# Altium project SSL-PowerBoard-2020.PrjPcb
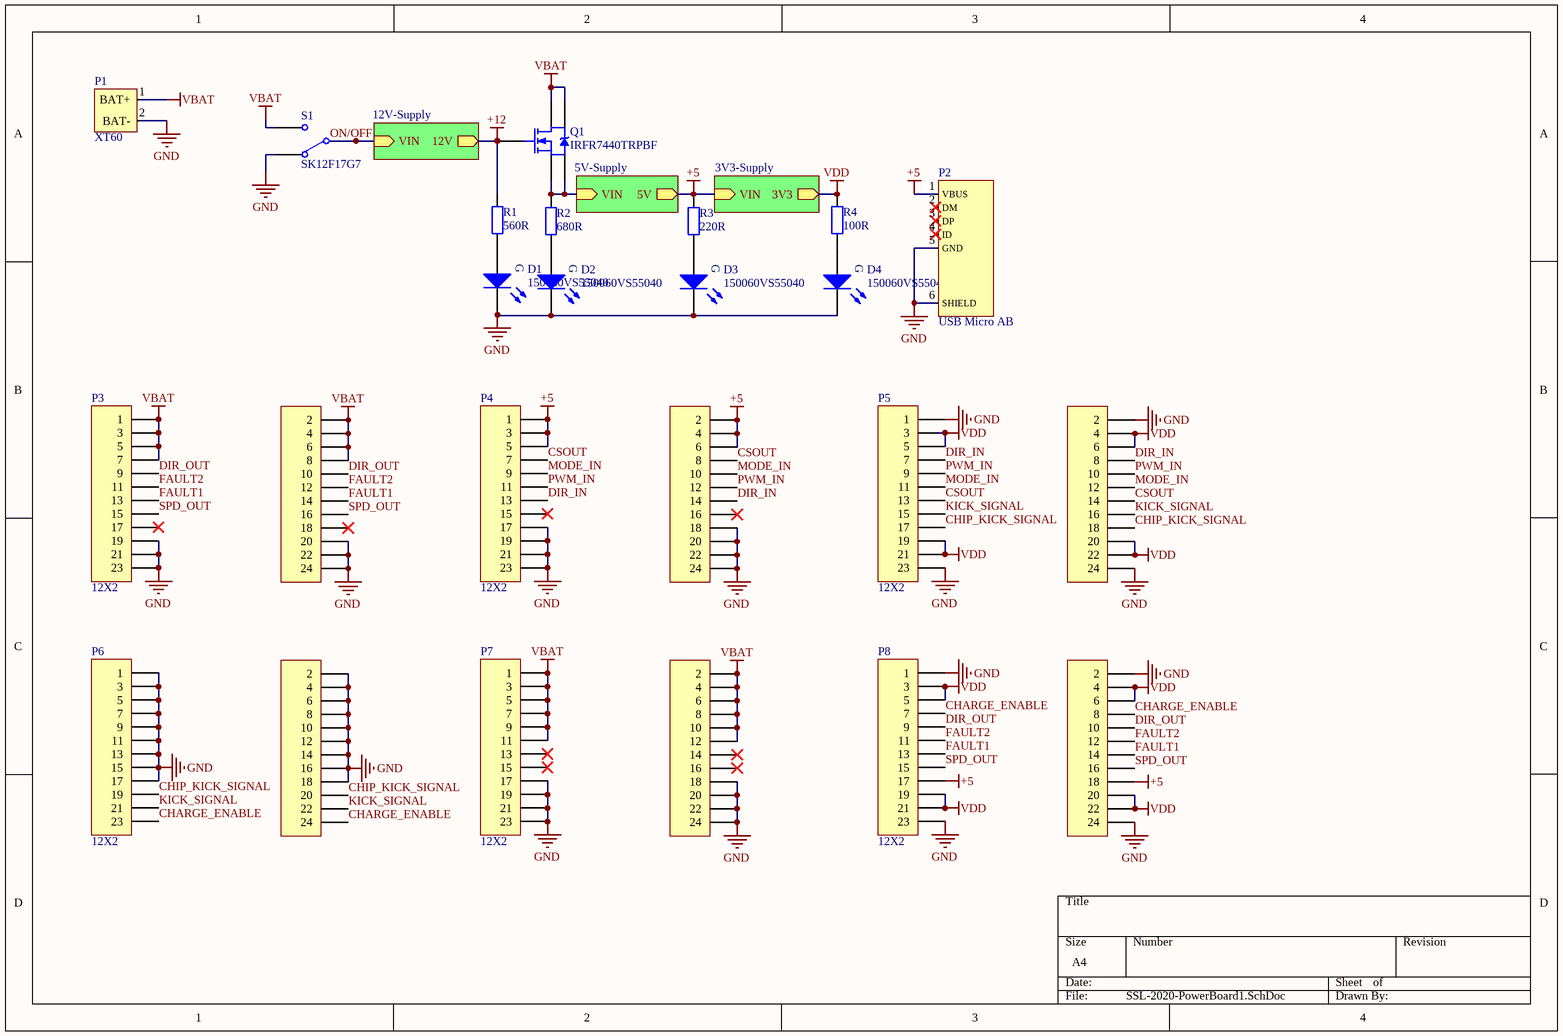
[diagram p0: SSL-2020-PowerBoard1.SchDoc]
5 sheets, 66 parts. Net scope: hierarchical (ports join the sheet entries above them; power ports are global).
Board file: SSL-2020-PowerBoard1.PcbDoc
Sheets:
  SSL-2020-PowerBoard1.SchDoc
    12V-Supply = VREG_12V.SchDoc
    5V-Supply = VREG_5V.SchDoc
    3V3-Supply = VREG_3V3.SchDoc
  SSL-2020-MCUBoard1.SchDoc

## Sheet SSL-2020-PowerBoard1.SchDoc
size A4

### Parts
D1  150060VS55040  [LED 0603 GREEN]
D2  150060VS55040  [LED 0603 GREEN]
D3  150060VS55040  [LED 0603 GREEN]
D4  150060VS55040  [LED 0603 GREEN]
P1  XT60  [XT60-Male]
P2  USB Micro AB  [USB-MICRO-AB]
P3  12X2  [HEADER 12X2 FEM]
P4  12X2  [HEADER 12X2 FEM]
P5  12X2  [HEADER 12X2 FEM]
P6  12X2  [HEADER 12X2 FEM]
P7  12X2  [HEADER 12X2 FEM]
P8  12X2  [HEADER 12X2 FEM]
Q1  IRFR7440TRPBF  [DPAK/TO-252-3]
R1  560R  [RES SMD 0603]
R2  680R  [RES SMD 0603]
R3  220R  [RES SMD 0603]
R4  100R  [RES SMD 0603]
S1  SK12F17G7  [SPDT-SWITCH]

### Sub-sheets
3V3-Supply = VREG_3V3.SchDoc: VIN (in), 3V3 (out)
5V-Supply = VREG_5V.SchDoc: VIN (in), 5V (out)
12V-Supply = VREG_12V.SchDoc: VIN (in), 12V (out)

### Nets
+5: P2.1(VBUS) P4.1 P4.2 P4.3 P4.4 P4.5 P4.6 P8.17 P8.18 R3.2 ; sheet 5V-Supply/5V, sheet 3V3-Supply/VIN
+12: Q1.1(G) R1.2 ; sheet 12V-Supply/12V
GND: D1.2(N) D2.2(N) D3.2(N) D4.2(N) P1.2(BAT-) P2.5(GND) P2.6(SHIELD) P3.19 P3.20 P3.21 P3.22 P3.23 P3.24 P4.17 P4.18 P4.19 P4.20 P4.21 P4.22 P4.23 P4.24 P5.1 P5.2 P5.23 P5.24 P6.1 P6.2 P6.3 P6.4 P6.5 P6.6 P6.7 P6.8 P6.9 P6.10 P6.11 P6.12 P6.13 P6.14 P6.15 P6.16 P6.17 P6.18 P7.17 P7.18 P7.19 P7.20 P7.21 P7.22 P7.23 P7.24 P8.1 P8.2 P8.23 P8.24 S1.1(NC1)
VBAT: P1.1(BAT+) P3.1 P3.2 P3.3 P3.4 P3.5 P3.6 P3.7 P3.8 P7.1 P7.2 P7.3 P7.4 P7.5 P7.6 P7.7 P7.8 P7.9 P7.10 P7.11 P7.12 Q1.2(D) S1.3(NO1)
VDD: P5.3 P5.4 P5.5 P5.6 P5.19 P5.20 P5.21 P5.22 P8.3 P8.4 P8.5 P8.6 P8.19 P8.20 P8.21 P8.22 R4.2 ; sheet 3V3-Supply/3V3
CHARGE_ENABLE: P6.23 P6.24 P8.7 P8.8
CHIP_KICK_SIGNAL: P5.17 P5.18 P6.19 P6.20
CSOUT: P4.7 P4.8 P5.13 P5.14
DIR_IN: P4.13 P4.14 P5.7 P5.8
DIR_OUT: P3.9 P3.10 P8.9 P8.10
FAULT1: P3.13 P3.14 P8.13 P8.14
FAULT2: P3.11 P3.12 P8.11 P8.12
KICK_SIGNAL: P5.15 P5.16 P6.21 P6.22
MODE_IN: P4.9 P4.10 P5.11 P5.12
ON/OFF: S1.2(COMMON1) ; sheet 12V-Supply/VIN
PWM_IN: P4.11 P4.12 P5.9 P5.10
SPD_OUT: P3.15 P3.16 P8.15 P8.16
NetC5_1: Q1.3(S) R2.2 ; sheet 5V-Supply/VIN
NetD1_1: D1.1(P) R1.1
NetD2_1: D2.1(P) R2.1
NetD3_1: D3.1(P) R3.1
NetD4_1: D4.1(P) R4.1

Not connected (* = marked no-connect by the designer): P2 2(DM)* 3(DP)* 4(ID)*; P3 17* 18*; P4 15* 16*; P7 13* 14* 15* 16*

### Notes on the sheet
- (in symbol 150060VS55040) G

### Library data of the parts
D1-D4 = 150060VS55040: Standard LEDs - SMD WL-SMCD SMD MonoChip 0603 BrtGrn 575nm; Mfr: Wurth Elektronik; Forward Current: 20mA; Forward Voltage: 2V; Color: Green; Package: 0603 (1608 metric); Series: WL-SMCD
P1 = XT60: DFRobot Accessories High Quality Gold Plated XT60 Male &amp; Female Bullet Connector; Mfr Nr: FIT0587; Mfr: DFRobot; Type: XT60 Male Connector
P2 = USB Micro AB: USB Connectors WR-COM USB Micro SMT Type AB Horiztl; Mfr: Wurth Elektronik; Mfr Nr: 629105150921; Current Rating: 1.8 A; Gender: Jack (Female); Type: Micro USB AB; Series: WR-COM
P3-P8 = HEADER 12P FEM: Headers & Wire Housings 12+12 DIL VERTICAL SOCKET GOLD+TIN; Mfr: Harwin; Mfr Nr: M20-7831242; Pitch: 2.54mm; Series: M20; Type: Socket Assembly
Q1 = IRFR7440TRPBF: MOSFET 40V 90A 2.5mOhm 89nC StrongIRFET; Mfr: Infineon / IR; Type: N-Channel MOSFET; Package: TO-252-3
R1 = RES SMD 0603 560R: Thick Film Resistors 1/10watt 560ohms 5%; Mfr: Vishay / Dale; Mfr Nr: CRCW0603560RJNEA; Power Rating: 1/10 W; Dimensions: 0603 (1608 metric); Value: 560R
R2 = RES SMD 0603 680R: Thick Film Resistors 1/10Watt 680ohms 5% Commercial Use; Mfr: Vishay / Dale; Mfr Nr: CRCW0603680RJNEAC; Power Rating: 1/10 W; Dimensions: 0603 (1608 metric); Value: 680R
R3 = RES SMD 0603 220R: Thick Film Resistors 1/10Watt 220ohms 5% Commercial Use; Mfr: Vishay / Dale; Mfr Nr: CRCW0603220RJNEAC; Power Rating: 1/10 W; Dimensions: 0603 (1608 metric); Value: 220R
R4 = RES SMD 0603 100R: Thick Film Resistors 1/10Watt 100ohms 1% Commercial Use; Mfr: Vishay / Dale; Mfr Nr: CRCW0603100RFKEAC; Power Rating: 1/10 W; Dimensions: 0603 (1608 metric); Value: 100R
S1 = SK12F17G7: Slide Switches SPDT 0.3 Amp at 30 V; Mfr: C&K; Current Rating: 300 mA; Voltage Rating: 30 VDC; Contact Form: SPDT; Type: Slide Switch; Series: SK

## Sheet VREG_12V.SchDoc
size A4
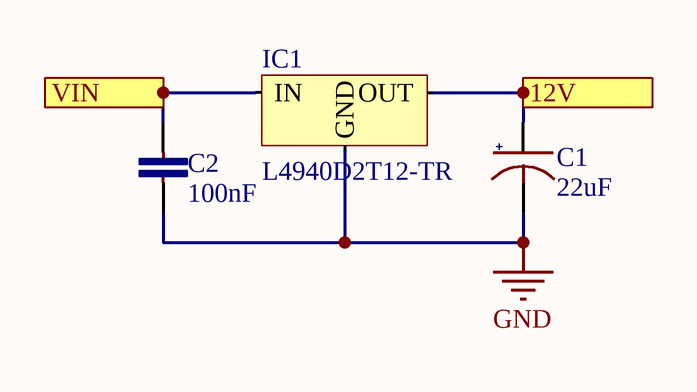
[diagram p1: VREG_12V.SchDoc]

### Parts
C1  22uF  [CAP ALUM 5X5]
C2  100nF  [CAP CER 0603]
IC1  L4940D2T12-TR  [D2PAK]

### Ports
12V (out), VIN (in)

### Nets
+12: C1.1 IC1.3(OUT) ; port 12V
GND: C1.2 C2.2 IC1.2(GND)
ON/OFF: C2.1 IC1.1(IN) ; port VIN

### Library data of the parts
C1 = CAP ALUM 25V 22uF: Aluminum Electrolytic Capacitors - SMD 25V 22uF 20% AEC-Q200; Mfr: KEMET; Mfr Nr: EDH226M025S9DAA; Type: Surface Mount Aluminum Electrolytic Capacitor; Dimensions: 5x5mm; Voltage Rating: 25V; Series: EDH; Value: 22uF
C2 = CAP CER 0603 25V 100nF: Multilayer Ceramic Capacitors MLCC - SMD/SMT 25V 0.1uF 0603 Y5V -20/+80%; Mfr Nr: C0603C104Z3VACTU; Mfr: KEMET; Type: Ceramic Capacitor; Dimensions: 0603 (1608 metric); Voltage Rating: 25V; Series: SMD Comm Y5V; Value: 100nF
IC1 = L4940D2T12-TR: LDO Voltage Regulators 1.5A Regulator Lo Drop; Mfr: STMicroelectronics; Package: D2PAK; Series: L4940

## Sheet VREG_5V.SchDoc
size A4
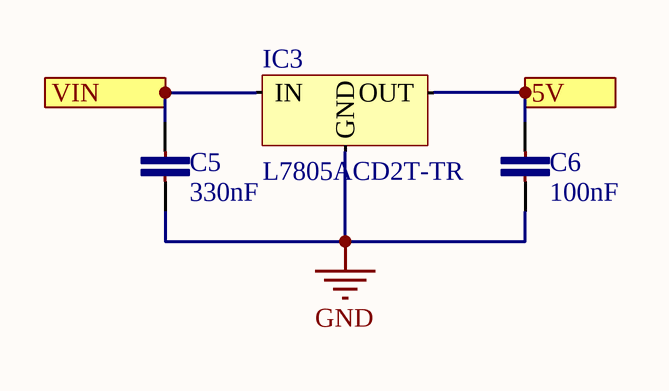
[diagram p2: VREG_5V.SchDoc]

### Parts
C5  330nF
C6  100nF  [CAP CER 0603]
IC3  L7805ACD2T-TR

### Ports
5V (out), VIN (in)

### Nets
+5: C6.1 IC3.3(OUT) ; port 5V
GND: C5.2 C6.2 IC3.2(GND)
NetC5_1: C5.1 IC3.1(IN) ; port VIN

### Library data of the parts
C5 = CAP CER 0603 25V 330nF: Multilayer Ceramic Capacitors MLCC - SMD/SMT 0603 25VDC 0.33uF 10% X5R 0.8mm; Mfr Nr: C1608X5R1E334K080AC; Mfr: TDK; Voltage Rating: 25V; Type: Ceramic Capacitor; Dimensions: 0603 (1608 metric); Value: 330nF; Series: C
C6 = CAP CER 0603 25V 100nF: as C2 on sheet VREG_12V; Type: Ceramic Capacitor; Dimensions: 0603 (1608 metric); Voltage Rating: 25V; Series: SMD Comm Y5V; Value: 100nF
IC3 = L7805ACD2T-TR: Linear Voltage Regulators 5.0V 1.0A Positive; Mfr: STMicroelectronics; Package: D2PAK; Series: L78

## Sheet VREG_3V3.SchDoc
size A4
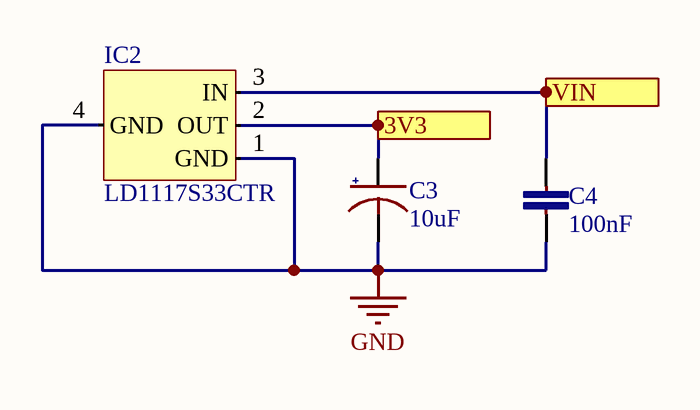
[diagram p3: VREG_3V3.SchDoc]

### Parts
C3  10uF  [CAP ALUM 5X5]
C4  100nF  [CAP CER 0603]
IC2  LD1117S33CTR  [SOT-223]

### Ports
3V3 (out), VIN (in)

### Nets
+5: C4.1 IC2.3(IN) ; port VIN
GND: C3.2 C4.2 IC2.1(GND) IC2.4(GND)
VDD: C3.1 IC2.2(OUT) ; port 3V3

### Library data of the parts
C3 = CAP ALUM 25V 10uF: Aluminum Electrolytic Capacitors - SMD 25volts 10uF 5x5.4 20%; Mfr: Nichion; Mfr Nr: UWX1E100MCL1GB; Voltage Rating: 25V; Type: Surface Mount Aluminum Electrolytic Capacitor; Dimensions: 5x5mm; Series: UWX; Value: 10uF
C4 = CAP CER 0603 25V 100nF: as C2 on sheet VREG_12V; Type: Ceramic Capacitor; Dimensions: 0603 (1608 metric); Value: 100nF; Voltage Rating: 25V; Series: SMD Comm Y5V
IC2 = LD1117S33CTR: LDO Voltage Regulators 3.3V 0.8A Positive; Mfr: STMicroelectronics; Series: LD1117; Package: SOT-223-3

## Sheet SSL-2020-MCUBoard1.SchDoc
size A4
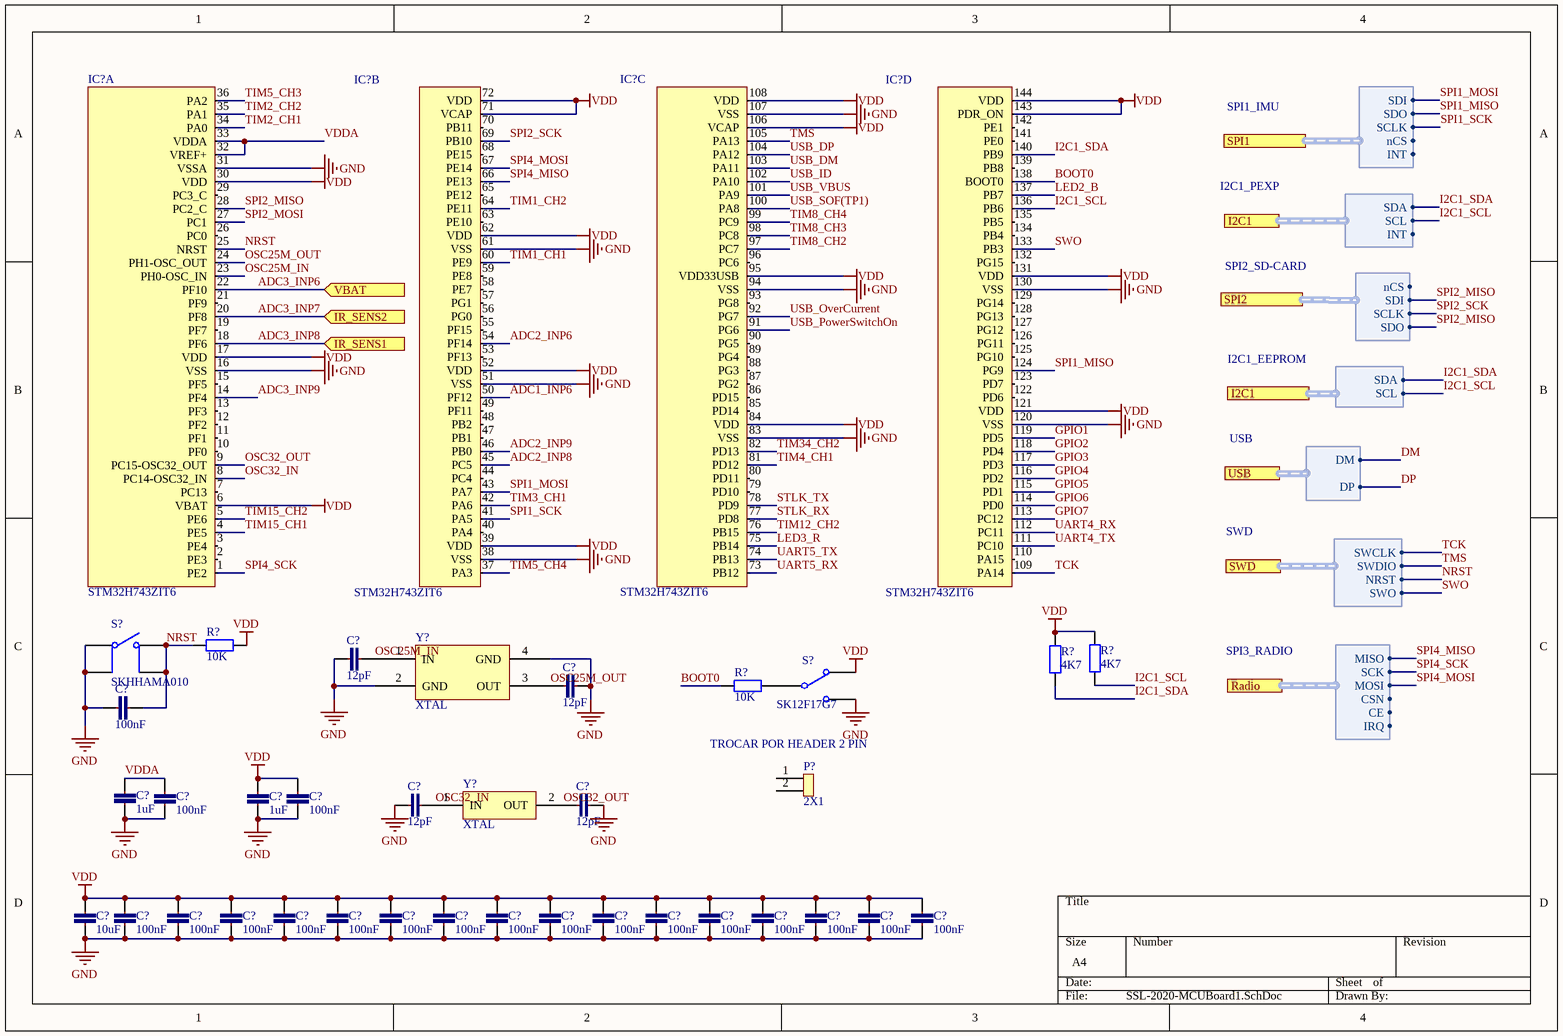
[diagram p4: SSL-2020-MCUBoard1.SchDoc]

### Parts
(Parts that share a designator on the sheet are numbered #1, #2 ... from top to bottom, then left to right.)
C?#1  12pF  [CAP CER 0603]
C?#2  12pF  [CAP CER 0603]
C?#3  100nF  [CAP CER 0603]
C?#4  1uF  [CAP CER 0603]
C?#5  100nF  [CAP CER 0603]
C?#6  1uF  [CAP CER 0603]
C?#7  100nF  [CAP CER 0603]
C?#8  12pF  [CAP CER 0603]
C?#9  12pF  [CAP CER 0603]
C?#10  10uF  [CAP CER 0603]
C?#11  100nF  [CAP CER 0603]
C?#12  100nF  [CAP CER 0603]
C?#13  100nF  [CAP CER 0603]
C?#14  100nF  [CAP CER 0603]
C?#15  100nF  [CAP CER 0603]
C?#16  100nF  [CAP CER 0603]
C?#17  100nF  [CAP CER 0603]
C?#18  100nF  [CAP CER 0603]
C?#19  100nF  [CAP CER 0603]
C?#20  100nF  [CAP CER 0603]
C?#21  100nF  [CAP CER 0603]
C?#22  100nF  [CAP CER 0603]
C?#23  100nF  [CAP CER 0603]
C?#24  100nF  [CAP CER 0603]
C?#25  100nF  [CAP CER 0603]
C?#26  100nF  [CAP CER 0603]
IC?#1  STM32H743ZIT6  [LQFP-144]  (part A of 4)
IC?#2  STM32H743ZIT6  [LQFP-144]  (part B of 4)
IC?#3  STM32H743ZIT6  [LQFP-144]  (part C of 4)
IC?#4  STM32H743ZIT6  [LQFP-144]  (part D of 4)
P?  2X1  [HEADER 2X1 MALE]
R?#1  10K  [RES SMD 0603]
R?#2  4K7  [RES SMD 0603]
R?#3  4K7  [RES SMD 0603]
R?#4  10K  [RES SMD 0603]
S?#1  SKHHAMA010  [TACT-SWITCH-6X6X5]
S?#2  SK12F17G7  [SPDT-SWITCH]
Y?#1  XTAL  [XTAL-200X160]
Y?#2  XTAL  [XTAL-200X120]

### Ports
I2C1 (harness I2C1_EEPROM), I2C1 (harness I2C1_PEXP), IR_SENS1 (in), IR_SENS2 (in), Radio (harness SPI3_RADIO), SPI1 (harness SPI1_IMU), SPI2 (harness SPI2_SD-CARD), SWD (harness SWD), USB (harness USB), VBAT (in)

### Harnesses
SPI1_IMU: SDI, SDO, SCLK, nCS, INT
I2C1_PEXP: SDA, SCL, INT
SPI2_SD-CARD: nCS, SDI, SCLK, SDO
I2C1_EEPROM: SDA, SCL
SWD: SWCLK, SWDIO, NRST, SWO
USB: DM, DP
SPI3_RADIO: MISO, SCK, MOSI, CSN, CE, IRQ

### Nets
GND: C?#1.1 C?#2.2 C?#3.1 C?#4.2 C?#5.2 C?#6.2 C?#7.2 C?#8.1 C?#9.2 C?#10.2 C?#11.2 C?#12.2 C?#13.2 C?#14.2 C?#15.2 C?#16.2 C?#17.2 C?#18.2 C?#19.2 C?#20.2 C?#21.2 C?#22.2 C?#23.2 C?#24.2 C?#25.2 C?#26.2 IC?#1.16(VSS) IC?#1.31(VSSA) IC?#2.38(VSS) IC?#2.51(VSS) IC?#2.61(VSS) IC?#3.83(VSS) IC?#3.94(VSS) IC?#3.107(VSS) IC?#4.120(VSS) IC?#4.130(VSS) S?#1.1 S?#1.2 S?#2.3(NO1) Y?#1.2(GND) Y?#1.4(GND)
VDD: C?#6.1 C?#7.1 C?#10.1 C?#11.1 C?#12.1 C?#13.1 C?#14.1 C?#15.1 C?#16.1 C?#17.1 C?#18.1 C?#19.1 C?#20.1 C?#21.1 C?#22.1 C?#23.1 C?#24.1 C?#25.1 C?#26.1 IC?#1.6(VBAT) IC?#1.17(VDD) IC?#1.30(VDD) IC?#2.39(VDD) IC?#2.52(VDD) IC?#2.62(VDD) IC?#2.71(VCAP) IC?#2.72(VDD) IC?#3.84(VDD) IC?#3.95(VDD33USB) IC?#3.106(VCAP) IC?#3.108(VDD) IC?#4.121(VDD) IC?#4.131(VDD) IC?#4.143(PDR_ON) IC?#4.144(VDD) R?#1.1 R?#2.2 R?#3.2 S?#2.1(NC1)
ADC1_INP6: IC?#2.50(PF12)
ADC2_INP6: IC?#2.54(PF14)
ADC2_INP8: IC?#2.45(PC5)
ADC2_INP9: IC?#2.46(PB0)
ADC3_INP6: IC?#1.22(PF10) ; port VBAT
ADC3_INP7: IC?#1.20(PF8) ; port IR_SENS2
ADC3_INP8: IC?#1.18(PF6) ; port IR_SENS1
ADC3_INP9: IC?#1.14(PF4)
BOOT0: IC?#4.138(BOOT0) R?#4.2
DM: port USB.DM
DP: port USB.DP
GPIO1: IC?#4.119(PD5)
GPIO2: IC?#4.118(PD4)
GPIO3: IC?#4.117(PD3)
GPIO4: IC?#4.116(PD2)
GPIO5: IC?#4.115(PD1)
GPIO6: IC?#4.114(PD0)
GPIO7: IC?#4.113(PC12)
I2C1_SCL: IC?#4.136(PB6) R?#3.1 ; port I2C1.SCL
I2C1_SDA: IC?#4.140(PB9) R?#2.1 ; port I2C1.SDA
LED2_B: IC?#4.137(PB7)
LED3_R: IC?#3.75(PB14)
NRST: C?#3.2 IC?#1.25(NRST) R?#1.2 S?#1.3 S?#1.4 ; port SWD.NRST
OSC25M_IN: C?#1.2 IC?#1.23(PH0-OSC_IN) Y?#1.1(IN)
OSC25M_OUT: C?#2.1 IC?#1.24(PH1-OSC_OUT) Y?#1.3(OUT)
OSC32_IN: C?#8.2 IC?#1.8(PC14-OSC32_IN)
OSC32_OUT: C?#9.1 IC?#1.9(PC15-OSC32_OUT)
SPI1_MISO: IC?#4.124(PG9) ; port SPI1.SDO
SPI1_MOSI: IC?#2.43(PA7) ; port SPI1.SDI
SPI1_SCK: IC?#2.41(PA5) ; port SPI1.SCLK
SPI2_MISO: IC?#1.28(PC2_C) ; port SPI2.SDI, port SPI2.SDO
SPI2_MOSI: IC?#1.27(PC1)
SPI2_SCK: IC?#2.69(PB10) ; port SPI2.SCLK
SPI4_MISO: IC?#2.66(PE13) ; port Radio.MISO
SPI4_MOSI: IC?#2.67(PE14) ; port Radio.MOSI
SPI4_SCK: IC?#1.1(PE2) ; port Radio.SCK
STLK_RX: IC?#3.77(PD8)
STLK_TX: IC?#3.78(PD9)
SWO: IC?#4.133(PB3) ; port SWD.SWO
TCK: IC?#4.109(PA14) ; port SWD.SWCLK
TIM1_CH1: IC?#2.60(PE9)
TIM1_CH2: IC?#2.64(PE11)
TIM2_CH1: IC?#1.34(PA0)
TIM2_CH2: IC?#1.35(PA1)
TIM3_CH1: IC?#2.42(PA6)
TIM4_CH1: IC?#3.81(PD12)
TIM5_CH3: IC?#1.36(PA2)
TIM5_CH4: IC?#2.37(PA3)
TIM8_CH2: IC?#3.97(PC7)
TIM8_CH3: IC?#3.98(PC8)
TIM8_CH4: IC?#3.99(PC9)
TIM12_CH2: IC?#3.76(PB15)
TIM15_CH1: IC?#1.4(PE5)
TIM15_CH2: IC?#1.5(PE6)
TIM34_CH2: IC?#3.82(PD13)
TMS: IC?#3.105(PA13) ; port SWD.SWDIO
UART4_RX: IC?#4.112(PC11)
UART4_TX: IC?#4.111(PC10)
UART5_RX: IC?#3.73(PB12)
UART5_TX: IC?#3.74(PB13)
USB_DM: IC?#3.103(PA11)
USB_DP: IC?#3.104(PA12)
USB_ID: IC?#3.102(PA10)
USB_OverCurrent: IC?#3.92(PG7)
USB_PowerSwitchOn: IC?#3.91(PG6)
USB_SOF(TP1): IC?#3.100(PA8)
USB_VBUS: IC?#3.101(PA9)
VDDA: C?#4.1 C?#5.1 IC?#1.32(VREF+) IC?#1.33(VDDA)
NetR?#4_1: R?#4.1 S?#2.2(COMMON1)

Not connected (* = marked no-connect by the designer): IC?#1 2(PE3) 3(PE4) 7(PC13) 10(PF0) 11(PF1) 12(PF2) 13(PF3) 15(PF5) 19(PF7) 21(PF9) 26(PC0) 29(PC3_C); IC?#2 40(PA4) 44(PC4) 47(PB1) 48(PB2) 49(PF11) 53(PF13) 55(PF15) 56(PG0) 57(PG1) 58(PE7) 59(PE8) 63(PE10) 65(PE12) 68(PE15) 70(PB11); IC?#3 79(PD10) 80(PD11) 85(PD14) 86(PD15) 87(PG2) 88(PG3) 89(PG4) 90(PG5) 93(PG8) 96(PC6); IC?#4 110(PA15) 122(PD6) 123(PD7) 125(PG10) 126(PG11) 127(PG12) 128(PG13) 129(PG14) 132(PG15) 134(PB4) 135(PB5) 139(PB8) 141(PE0) 142(PE1); P? 1 2; Y?#2 1(IN) 2(OUT)

### Notes on the sheet
- TROCAR POR HEADER 2 PIN

### Library data of the parts
C?#1 C?#2 C?#8 C?#9 = CAP CER 0603 50V 12pF: Multilayer Ceramic Capacitors MLCC - SMD/SMT 50V 12pF 0603 C0G 5%; Mfr Nr: C0603C120J5GAC; Mfr: KEMET; Type: Ceramic Capacitor; Dimensions: 0603 (1608 metric); Series: SMD Comm C0G; Voltage Rating: 50V; Value: 12pF
C?#3 C?#5 C?#7 C?#11-C?#26 = CAP CER 0603 25V 100nF: as C2 on sheet VREG_12V; Type: Ceramic Capacitor; Dimensions: 0603 (1608 metric); Voltage Rating: 25V; Series: SMD Comm Y5V; Value: 100nF
C?#4 C?#6 = CAP CER 0603 25V 1uF: Multilayer Ceramic Capacitors MLCC - SMD/SMT 1uF 25V X5R 10%; Mfr Nr: C0603C105K3PAC7411; Mfr: KEMET; Type: Ceramic Capacitor; Dimensions: 0603 (1608 metric); Voltage Rating: 25V; Series: SMD Comm X5R; Value: 1uF
C?#10 = CAP CER 0603 6.3V 10uF: Multilayer Ceramic Capacitors MLCC - SMD/SMT 0603 6.3V 10uF X5R 10% Soft Term; Mfr Nr: C1608X5R0J106K080AE; Mfr: TDK; Type: Ceramic Capacitor; Dimensions: 0603 (1608 metric); Voltage Rating: 6.3V; Series: C; Value: 10uF
IC?#1-IC?#4 = STM32H743ZIT6: ARM Microcontrollers - MCU High-performance and DSP with DP-FPU, ARM Cortex-M7 MCU with 2MBytes Flash, 1MB RAM, 400 MHz CPU, Art Accelerator, L1 cache, external memory interface, large set of peripherals; Mfr: STMicroelectronics; Core: ARM Cortex M7; Mfr Nr: STM32H743ZIT6; Package: LQFP-144; Series: STM32H743ZI
P? = HEADER 2P M
R?#1 R?#4 = RES SMD 0603 10K: Thick Film Resistors - SMD 1/10Watt 10Kohms 1% Commercial Use; Mfr: Vishay / Dale; Mfr Nr: CRCW060310K0FKEAC; Power Rating: 1/10 W; Dimensions: 0603 (1608 metric); Value: 10K
R?#2 R?#3 = RES SMD 0603 4K7
S?#1 = SKHHAMA010: Tactile Switches 6.0x6.0x5.0mm 160gf; Mfr: ALPS; Contact Form: SPST; Voltage Rating: 12 VDC; Current Rating: 50 mA; Mfr Nr: SKHHAMA010; Series: SKHH; Type: Tactile Switch
S?#2 = SK12F17G7: as S1 on sheet SSL-2020-PowerBoard1; Contact Form: SPDT; Type: Slide Switch; Series: SK; Mfr Nr: SK12F17G7
Y?#1 = FA-12825F10Z-AC: Crystals 25MHz 10PPM -20C +75C 9.0pF; Mfr Nr: FA-128  25.0000MF10Z-AC; Mfr: Epson Timing; Load Capacitance: 9 pF; ESR: 80 Ohms; Package: 2 mm x 1.6 mm; Frequency: 25 MHz; Series: FA-128; Tolerance: 10 PPM
Y?#2 = ABS06-32.768KHZ-9-T: Crystals 32.768KHz 9pF 20ppm -40 C+85C; Mfr: ABRACON; ESR: 90 kOhms; Mfr Nr: ABS06-32.768KHZ-9-T; Package: 2 mm x 1.6 mm; Load Capacitance: 9 pF; Frequency: 32.768 kHz; Series: ABS06; Tolerance: 20 PPM

## Nets that join several sheets
+5: SSL-2020-PowerBoard1 (10 pins), VREG_5V (C6.1 IC3.3), VREG_3V3 (C4.1 IC2.3)
+12: SSL-2020-PowerBoard1 (Q1.1 R1.2), VREG_12V (C1.1 IC1.3)
GND: SSL-2020-PowerBoard1 (56 pins), VREG_12V (C1.2 C2.2 IC1.2), VREG_5V (C5.2 C6.2 IC3.2), VREG_3V3 (C3.2 C4.2 IC2.1 IC2.4), SSL-2020-MCUBoard1 (41 pins)
VDD: SSL-2020-PowerBoard1 (17 pins), VREG_3V3 (C3.1 IC2.2), SSL-2020-MCUBoard1 (39 pins)
NetC5_1: SSL-2020-PowerBoard1 (Q1.3 R2.2), VREG_5V (C5.1 IC3.1)
ON/OFF: SSL-2020-PowerBoard1 (S1.2), VREG_12V (C2.1 IC1.1)